# Altium project meltdown_interface.PrjPcb
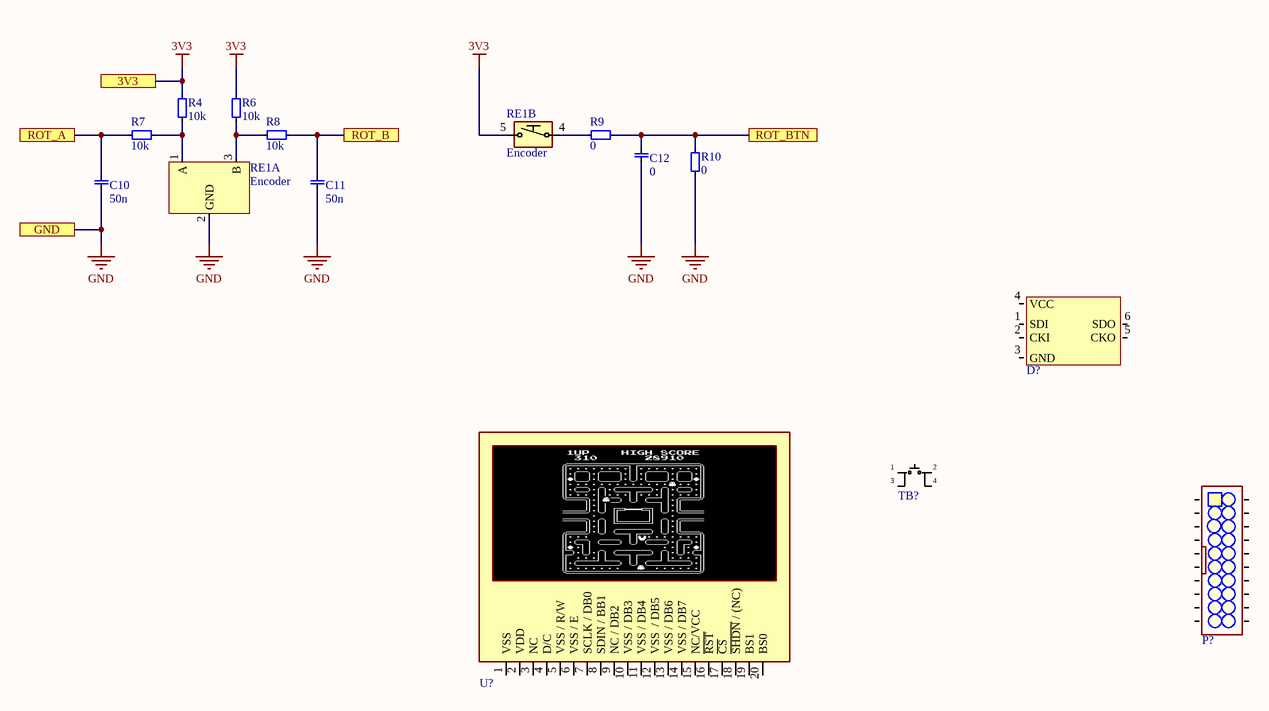
[diagram p0: meltdown_interface.SchDoc]
1 sheet, 14 parts. Net scope: flat (ports and power ports of the same name join across sheets).

## Sheet meltdown_interface.SchDoc
size A4; SheetNumber: 1; SheetTotal: 1

### Parts
C10  value 50n  [0603 cap]  (hidden comment: 0603, capacitor)
C11  value 50n  [0603 cap]  (hidden comment: 0603, capacitor)
C12  value 0  [0603 cap]  (hidden comment: 0603, capacitor)
D?  Neo - SK9822  [SK9822]  (value not drawn)
P?  2x10 Ribbon Header  [2x10_RIBBON_CABLE_CON]  (value not drawn)
R4  value 10k  [0603]  (hidden comment: 0603, resistor)
R6  value 10k  [0603]  (hidden comment: 0603, resistor)
R7  value 10k  [0603]  (hidden comment: 0603, resistor)
R8  value 10k  [0603]  (hidden comment: 0603, resistor)
R9  value 0  [0603]  (hidden comment: 0603, resistor)
R10  value 0  [0603]  (hidden comment: 0603, resistor)
RE1  Encoder  [RotaryEncoder]  (parts A,B of 2)
TB?  Tactile Button  [tacButton smd]  (value not drawn)
U?  NHD-2.7-12864WDW  [NHD-2.7-1286]  (value not drawn)

### Ports
3V3, GND, ROT_A, ROT_B, ROT_BTN

### Nets
3V3: R4.0 R6.0 RE1.5(B) ; port 3V3
GND: C10.0 C11.0 C12.0 R10.1 RE1.2(GND) ; port GND
NetC10_1: C10.1 R7.0 ; port ROT_A
NetC11_1: C11.1 R8.0 ; port ROT_B
NetC12_1: C12.1 R9.1 R10.0 ; port ROT_BTN
NetR4_1: R4.1 R7.1 RE1.1(A)
NetR6_1: R6.1 R8.1 RE1.3(B)
NetR9_0: R9.0 RE1.4(B)

Not connected (* = marked no-connect by the designer): D? 1(SDI) 2(CKI) 3(GND) 4(VCC) 5(CKO) 6(SDO); P? 1 2 3 4 5 6 7 8 9 10 11 12 13 14 15 16 17 18 19 20; TB? 1 2 3 4; U? 1(VSS) 2(VDD) 3(NC) 4(D/C) 5(VSS_/_R/W) 6(VSS_/_E) 7(SCLK_/_DB0) 8(SDIN_/_BB1) 9(NC_/_DB2) 10(VSS_/_DB3) 11(VSS_/_DB4) 12(VSS__/_DB5) 13(VSS_/_DB6) 14(VSS_/_DB7) 15(NC/VCC) 16(~{RST}) 17(~{CS}) 18(~{SHDN}_/_(NC)) 19(BS1) 20(BS0)

### Library data of the parts
D? = Neo - SK9822: Value: WS2812; DigiKey: 1568-1800-ND
P? = 2x10 Ribbon Header: 2.54 mm; Value: 1x10 Pin Header
RE1 = Rotary Encoder with Button
TB? = TacButton SMD: Tactile Switch Small Low; ELFA: 110-87-406; Value: Button SMD
U? = NHD-2.7-12864WDW: Graphic LCD Display Module White OLED - Passive Matrix Parallel/Serial 2.7" (68.58mm) 128 x 64
C10-C12 = 0603, capacitor: Order number: *